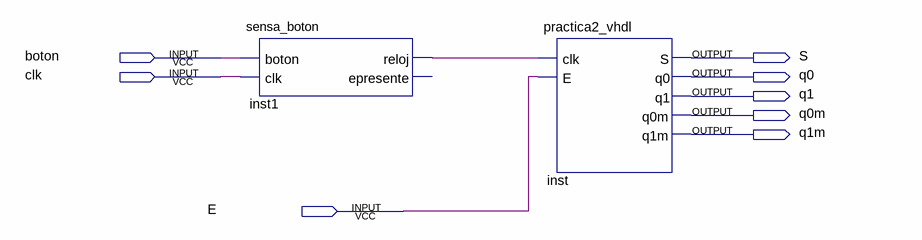
[diagram p0: schematic sheet]
// Quartus schematic Block2.bdf as structural Verilog: 2 symbols, 8 pins
module Block2 (
  input  boton,
  input  clk,
  input  E,
  output S,
  output q0,
  output q1,
  output q0m,
  output q1m
);

  wire inst1_reloj;

  sensa_boton inst1 (.boton(boton), .clk(clk), .reloj(inst1_reloj));  // open: epresente
  practica2_vhdl inst (.clk(inst1_reloj), .E(E), .S(S), .q0(q0), .q1(q1), .q0m(q0m), .q1m(q1m));
endmodule
